# EAGLE design led_analog_watch_face_v1_1 (EAGLE 5.11)
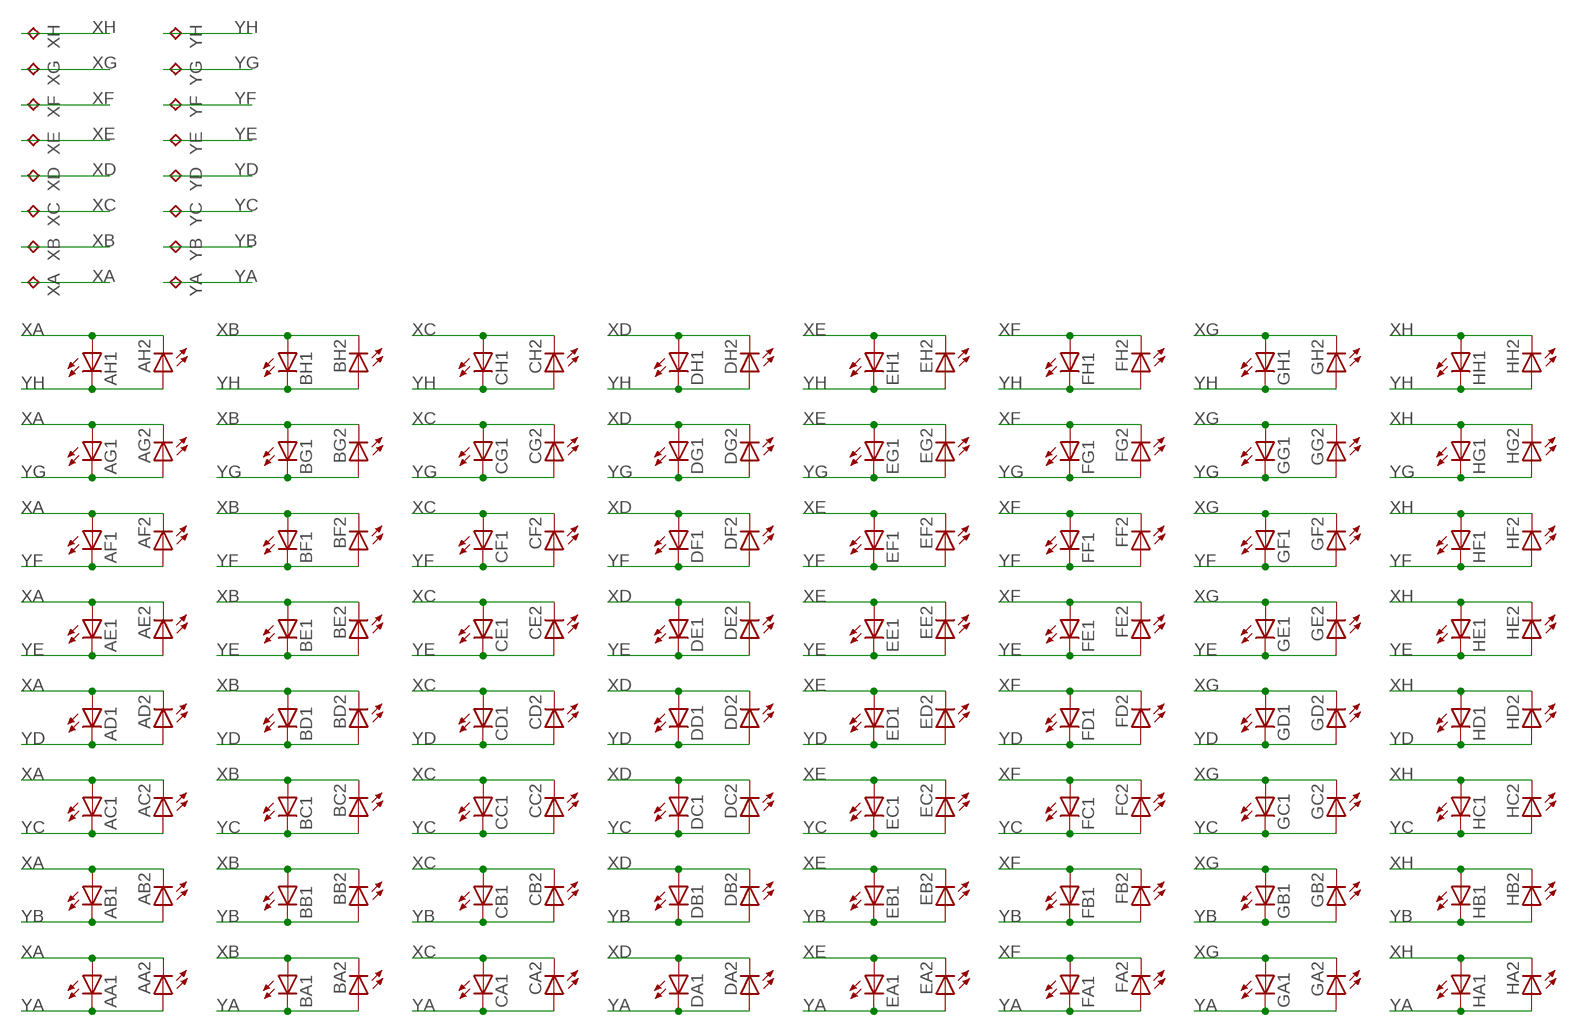
[diagram p0: schematic, sheet 1]

## Parts
AA1  LED-0402  [0402]
AA2  LED-0402  [0402]
AB1  LED-0402  [0402]
AB2  LED-0402  [0402]
AC1  LED-0402  [0402]
AC2  LED-0402  [0402]
AD1  LED-0402  [0402]
AD2  LED-0402  [0402]
AE1  LED-0402  [0402]
AE2  LED-0402  [0402]
AF1  LED-0402  [0402]
AF2  LED-0402  [0402]
AG1  LED-0402  [0402]
AG2  LED-0402  [0402]
AH1  LED-0402  [0402]
AH2  LED-0402  [0402]
BA1  LED-0402  [0402]
BA2  LED-0402  [0402]
BB1  LED-0402  [0402]
BB2  LED-0402  [0402]
BC1  LED-0402  [0402]
BC2  LED-0402  [0402]
BD1  LED-0402  [0402]
BD2  LED-0402  [0402]
BE1  LED-0402  [0402]
BE2  LED-0402  [0402]
BF1  LED-0402  [0402]
BF2  LED-0402  [0402]
BG1  LED-0402  [0402]
BG2  LED-0402  [0402]
BH1  LED-0402  [0402]
BH2  LED-0402  [0402]
CA1  LED-0402  [0402]
CA2  LED-0402  [0402]
CB1  LED-0402  [0402]
CB2  LED-0402  [0402]
CC1  LED-0402  [0402]
CC2  LED-0402  [0402]
CD1  LED-0402  [0402]
CD2  LED-0402  [0402]
CE1  LED-0402  [0402]
CE2  LED-0402  [0402]
CF1  LED-0402  [0402]
CF2  LED-0402  [0402]
CG1  LED-0402  [0402]
CG2  LED-0402  [0402]
CH1  LED-0402  [0402]
CH2  LED-0402  [0402]
DA1  LED-0402  [0402]
DA2  LED-0402  [0402]
DB1  LED-0402  [0402]
DB2  LED-0402  [0402]
DC1  LED-0402  [0402]
DC2  LED-0402  [0402]
DD1  LED-0402  [0402]
DD2  LED-0402  [0402]
DE1  LED-0402  [0402]
DE2  LED-0402  [0402]
DF1  LED-0402  [0402]
DF2  LED-0402  [0402]
DG1  LED-0402  [0402]
DG2  LED-0402  [0402]
DH1  LED-0402  [0402]
DH2  LED-0402  [0402]
EA1  LED-0402  [0402]
EA2  LED-0402  [0402]
EB1  LED-0402  [0402]
EB2  LED-0402  [0402]
EC1  LED-0402  [0402]
EC2  LED-0402  [0402]
ED1  LED-0402  [0402]
ED2  LED-0402  [0402]
EE1  LED-0402  [0402]
EE2  LED-0402  [0402]
EF1  LED-0402  [0402]
EF2  LED-0402  [0402]
EG1  LED-0402  [0402]
EG2  LED-0402  [0402]
EH1  LED-0402  [0402]
EH2  LED-0402  [0402]
FA1  LED-0402  [0402]
FA2  LED-0402  [0402]
FB1  LED-0402  [0402]
FB2  LED-0402  [0402]
FC1  LED-0402  [0402]
FC2  LED-0402  [0402]
FD1  LED-0402  [0402]
FD2  LED-0402  [0402]
FE1  LED-0402  [0402]
FE2  LED-0402  [0402]
FF1  LED-0402  [0402]
FF2  LED-0402  [0402]
FG1  LED-0402  [0402]
FG2  LED-0402  [0402]
FH1  LED-0402  [0402]
FH2  LED-0402  [0402]
GA1  LED-0402  [0402]
GA2  LED-0402  [0402]
GB1  LED-0402  [0402]
GB2  LED-0402  [0402]
GC1  LED-0402  [0402]
GC2  LED-0402  [0402]
GD1  LED-0402  [0402]
GD2  LED-0402  [0402]
GE1  LED-0402  [0402]
GE2  LED-0402  [0402]
GF1  LED-0402  [0402]
GF2  LED-0402  [0402]
GG1  LED-0402  [0402]
GG2  LED-0402  [0402]
GH1  LED-0402  [0402]
GH2  LED-0402  [0402]
HA1  LED-0402  [0402]
HA2  LED-0402  [0402]
HB1  LED-0402  [0402]
HB2  LED-0402  [0402]
HC1  LED-0402  [0402]
HC2  LED-0402  [0402]
HD1  LED-0402  [0402]
HD2  LED-0402  [0402]
HE1  LED-0402  [0402]
HE2  LED-0402  [0402]
HF1  LED-0402  [0402]
HF2  LED-0402  [0402]
HG1  LED-0402  [0402]
HG2  LED-0402  [0402]
HH1  LED-0402  [0402]
HH2  LED-0402  [0402]
XA  TPTP20R  [TP20R]
XB  TPTP20R  [TP20R]
XC  TPTP20R  [TP20R]
XD  TPTP20R  [TP20R]
XE  TPTP20R  [TP20R]
XF  TPTP20R  [TP20R]
XG  TPTP20R  [TP20R]
XH  TPTP20R  [TP20R]
YA  TPTP20R  [TP20R]
YB  TPTP20R  [TP20R]
YC  TPTP20R  [TP20R]
YD  TPTP20R  [TP20R]
YE  TPTP20R  [TP20R]
YF  TPTP20R  [TP20R]
YG  TPTP20R  [TP20R]
YH  TPTP20R  [TP20R]

## Nets
XA: AA1.1(A) AA2.2(C) AB1.1(A) AB2.2(C) AC1.1(A) AC2.2(C) AD1.1(A) AD2.2(C) AE1.1(A) AE2.2(C) AF1.1(A) AF2.2(C) AG1.1(A) AG2.2(C) AH1.1(A) AH2.2(C) XA.TP
XB: BA1.1(A) BA2.2(C) BB1.1(A) BB2.2(C) BC1.1(A) BC2.2(C) BD1.1(A) BD2.2(C) BE1.1(A) BE2.2(C) BF1.1(A) BF2.2(C) BG1.1(A) BG2.2(C) BH1.1(A) BH2.2(C) XB.TP
XC: CA1.1(A) CA2.2(C) CB1.1(A) CB2.2(C) CC1.1(A) CC2.2(C) CD1.1(A) CD2.2(C) CE1.1(A) CE2.2(C) CF1.1(A) CF2.2(C) CG1.1(A) CG2.2(C) CH1.1(A) CH2.2(C) XC.TP
XD: DA1.1(A) DA2.2(C) DB1.1(A) DB2.2(C) DC1.1(A) DC2.2(C) DD1.1(A) DD2.2(C) DE1.1(A) DE2.2(C) DF1.1(A) DF2.2(C) DG1.1(A) DG2.2(C) DH1.1(A) DH2.2(C) XD.TP
XE: EA1.1(A) EA2.2(C) EB1.1(A) EB2.2(C) EC1.1(A) EC2.2(C) ED1.1(A) ED2.2(C) EE1.1(A) EE2.2(C) EF1.1(A) EF2.2(C) EG1.1(A) EG2.2(C) EH1.1(A) EH2.2(C) XE.TP
XF: FA1.1(A) FA2.2(C) FB1.1(A) FB2.2(C) FC1.1(A) FC2.2(C) FD1.1(A) FD2.2(C) FE1.1(A) FE2.2(C) FF1.1(A) FF2.2(C) FG1.1(A) FG2.2(C) FH1.1(A) FH2.2(C) XF.TP
XG: GA1.1(A) GA2.2(C) GB1.1(A) GB2.2(C) GC1.1(A) GC2.2(C) GD1.1(A) GD2.2(C) GE1.1(A) GE2.2(C) GF1.1(A) GF2.2(C) GG1.1(A) GG2.2(C) GH1.1(A) GH2.2(C) XG.TP
XH: HA1.1(A) HA2.2(C) HB1.1(A) HB2.2(C) HC1.1(A) HC2.2(C) HD1.1(A) HD2.2(C) HE1.1(A) HE2.2(C) HF1.1(A) HF2.2(C) HG1.1(A) HG2.2(C) HH1.1(A) HH2.2(C) XH.TP
YA: AA1.2(C) AA2.1(A) BA1.2(C) BA2.1(A) CA1.2(C) CA2.1(A) DA1.2(C) DA2.1(A) EA1.2(C) EA2.1(A) FA1.2(C) FA2.1(A) GA1.2(C) GA2.1(A) HA1.2(C) HA2.1(A) YA.TP
YB: AB1.2(C) AB2.1(A) BB1.2(C) BB2.1(A) CB1.2(C) CB2.1(A) DB1.2(C) DB2.1(A) EB1.2(C) EB2.1(A) FB1.2(C) FB2.1(A) GB1.2(C) GB2.1(A) HB1.2(C) HB2.1(A) YB.TP
YC: AC1.2(C) AC2.1(A) BC1.2(C) BC2.1(A) CC1.2(C) CC2.1(A) DC1.2(C) DC2.1(A) EC1.2(C) EC2.1(A) FC1.2(C) FC2.1(A) GC1.2(C) GC2.1(A) HC1.2(C) HC2.1(A) YC.TP
YD: AD1.2(C) AD2.1(A) BD1.2(C) BD2.1(A) CD1.2(C) CD2.1(A) DD1.2(C) DD2.1(A) ED1.2(C) ED2.1(A) FD1.2(C) FD2.1(A) GD1.2(C) GD2.1(A) HD1.2(C) HD2.1(A) YD.TP
YE: AE1.2(C) AE2.1(A) BE1.2(C) BE2.1(A) CE1.2(C) CE2.1(A) DE1.2(C) DE2.1(A) EE1.2(C) EE2.1(A) FE1.2(C) FE2.1(A) GE1.2(C) GE2.1(A) HE1.2(C) HE2.1(A) YE.TP
YF: AF1.2(C) AF2.1(A) BF1.2(C) BF2.1(A) CF1.2(C) CF2.1(A) DF1.2(C) DF2.1(A) EF1.2(C) EF2.1(A) FF1.2(C) FF2.1(A) GF1.2(C) GF2.1(A) HF1.2(C) HF2.1(A) YF.TP
YG: AG1.2(C) AG2.1(A) BG1.2(C) BG2.1(A) CG1.2(C) CG2.1(A) DG1.2(C) DG2.1(A) EG1.2(C) EG2.1(A) FG1.2(C) FG2.1(A) GG1.2(C) GG2.1(A) HG1.2(C) HG2.1(A) YG.TP
YH: AH1.2(C) AH2.1(A) BH1.2(C) BH2.1(A) CH1.2(C) CH2.1(A) DH1.2(C) DH2.1(A) EH1.2(C) EH2.1(A) FH1.2(C) FH2.1(A) GH1.2(C) GH2.1(A) HH1.2(C) HH2.1(A) YH.TP

## Library data of the parts
AA1 AA2 AB1 AB2 AC1 AC2 AD1 AD2 AE1 AE2 AF1 AF2 AG1 AG2 AH1 AH2 BA1 BA2 BB1 BB2 BC1 BC2 BD1 BD2 BE1 BE2 BF1 BF2 BG1 BG2 BH1 BH2 CA1 CA2 CB1 CB2 CC1 CC2 CD1 CD2 CE1 CE2 CF1 CF2 CG1 CG2 CH1 CH2 DA1 DA2 DB1 DB2 DC1 DC2 DD1 DD2 DE1 DE2 DF1 DF2 DG1 DG2 DH1 DH2 EA1 EA2 EB1 EB2 EC1 EC2 ED1 ED2 EE1 EE2 EF1 EF2 EG1 EG2 EH1 EH2 FA1 FA2 FB1 FB2 FC1 FC2 FD1 FD2 FE1 FE2 FF1 FF2 FG1 FG2 FH1 FH2 GA1 GA2 GB1 GB2 GC1 GC2 GD1 GD2 GE1 GE2 GF1 GF2 GG1 GG2 GH1 GH2 HA1 HA2 HB1 HB2 HC1 HC2 HD1 HD2 HE1 HE2 HF1 HF2 HG1 HG2 HH1 HH2 = jcole:LED: LEDs Standard schematic elements and footprints for 5mm, 3mm, 1206, and 0603 sized LEDs. 5mm - Spark Fun Electronics SKU : COM-00529 (and others)
XA XB XC XD XE XF XG XH YA YB YC YD YE YF YG YH = testpad:TP: Test pad

## Net classes
0 signal: width 0.203 mm
1 supply: width 0.305 mm

## Board
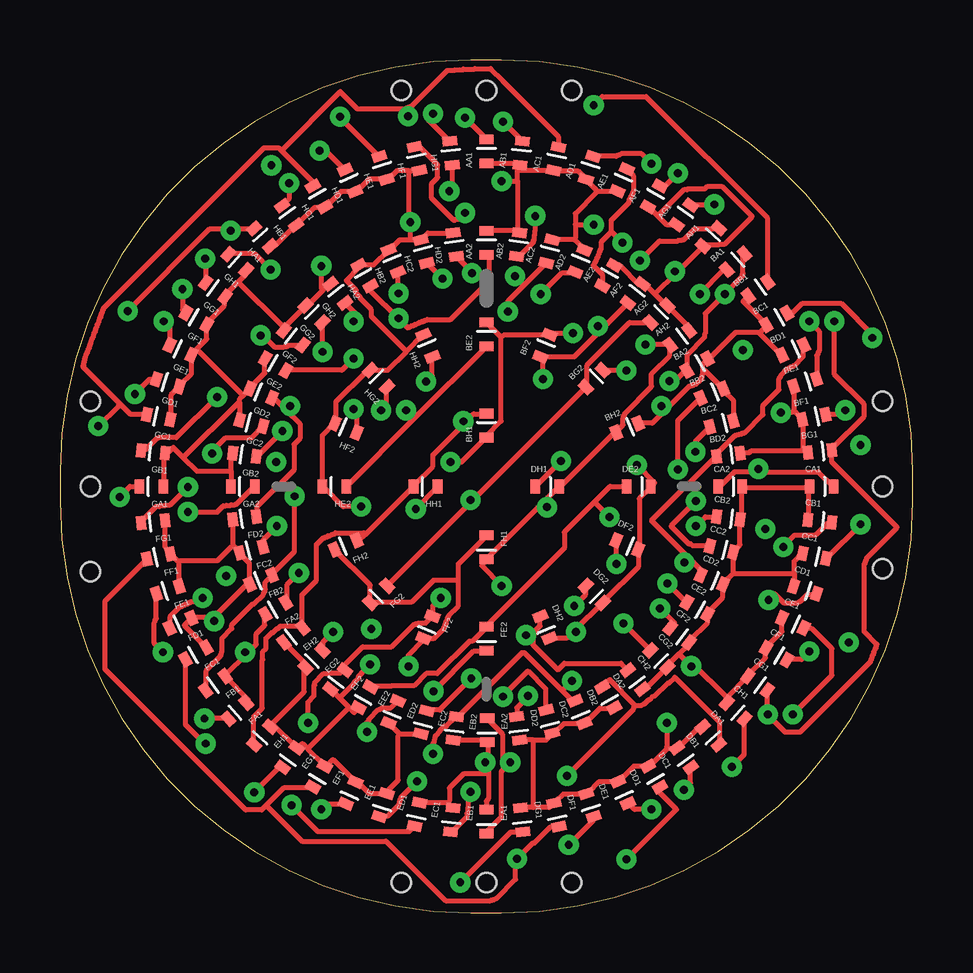
[diagram p1: board, top side]
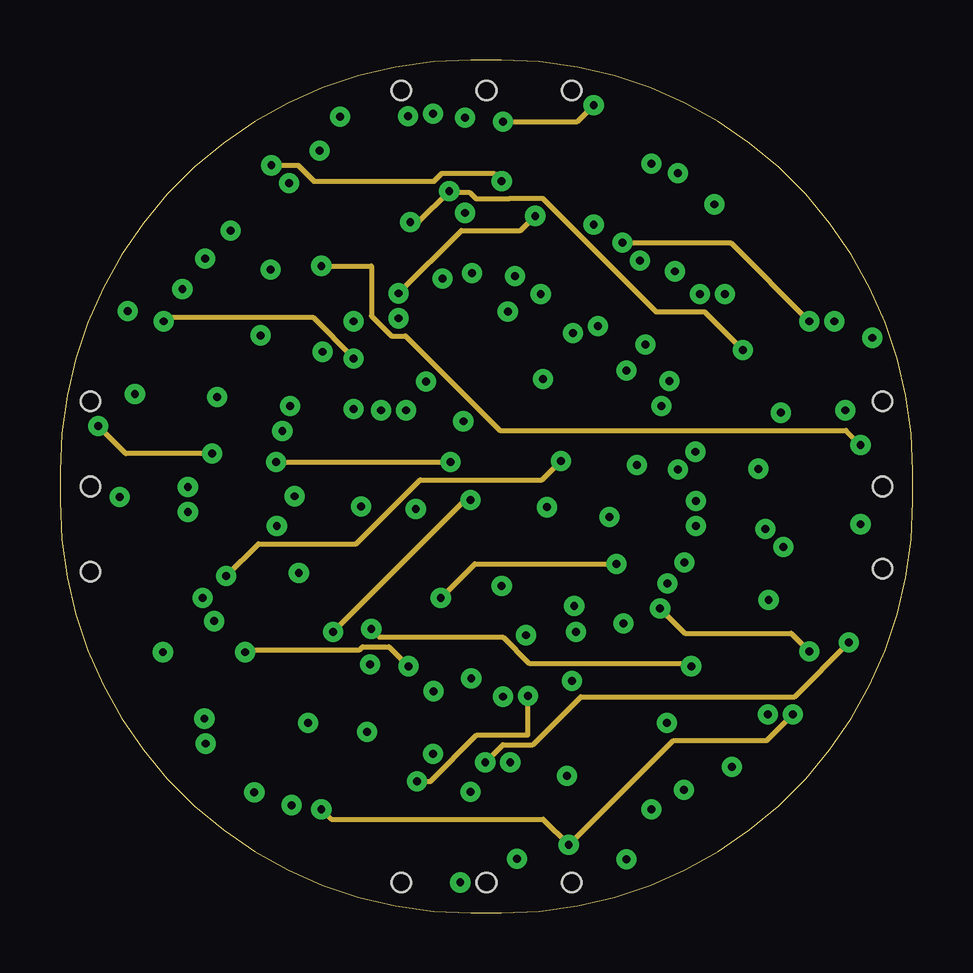
[diagram p2: board, inner layer Route2]
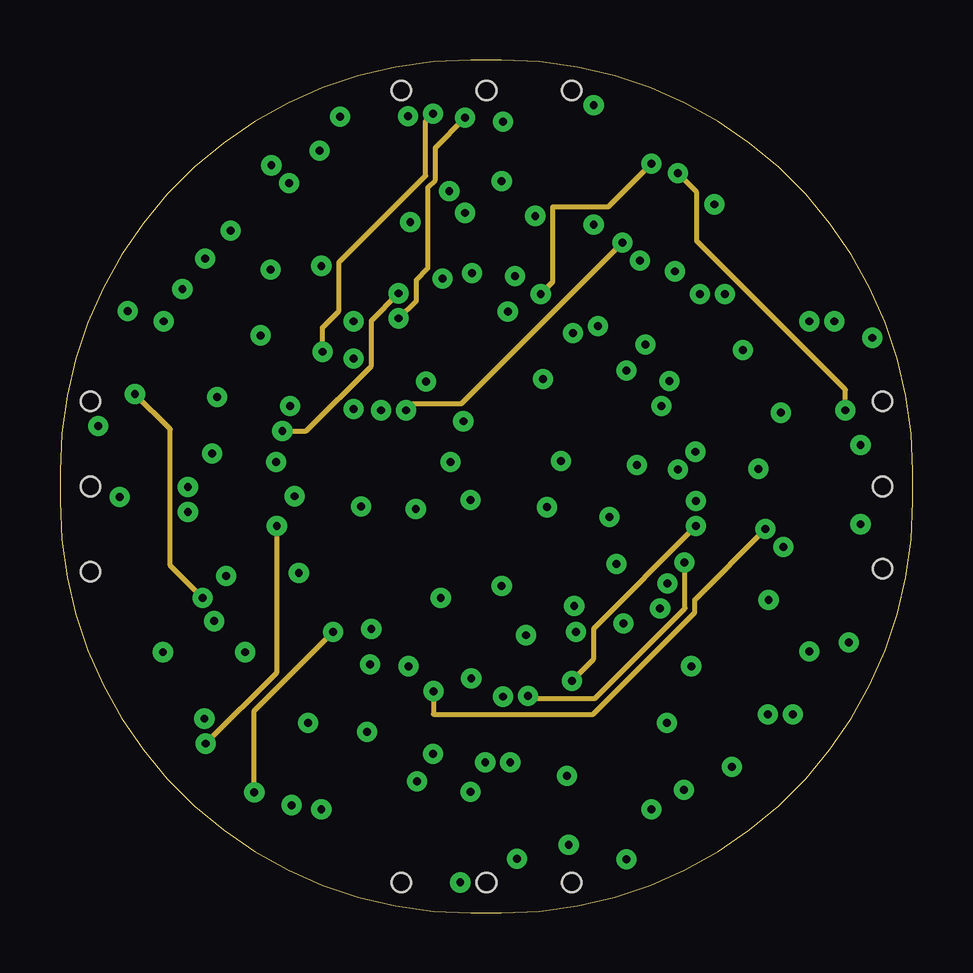
[diagram p3: board, inner layer Route15]
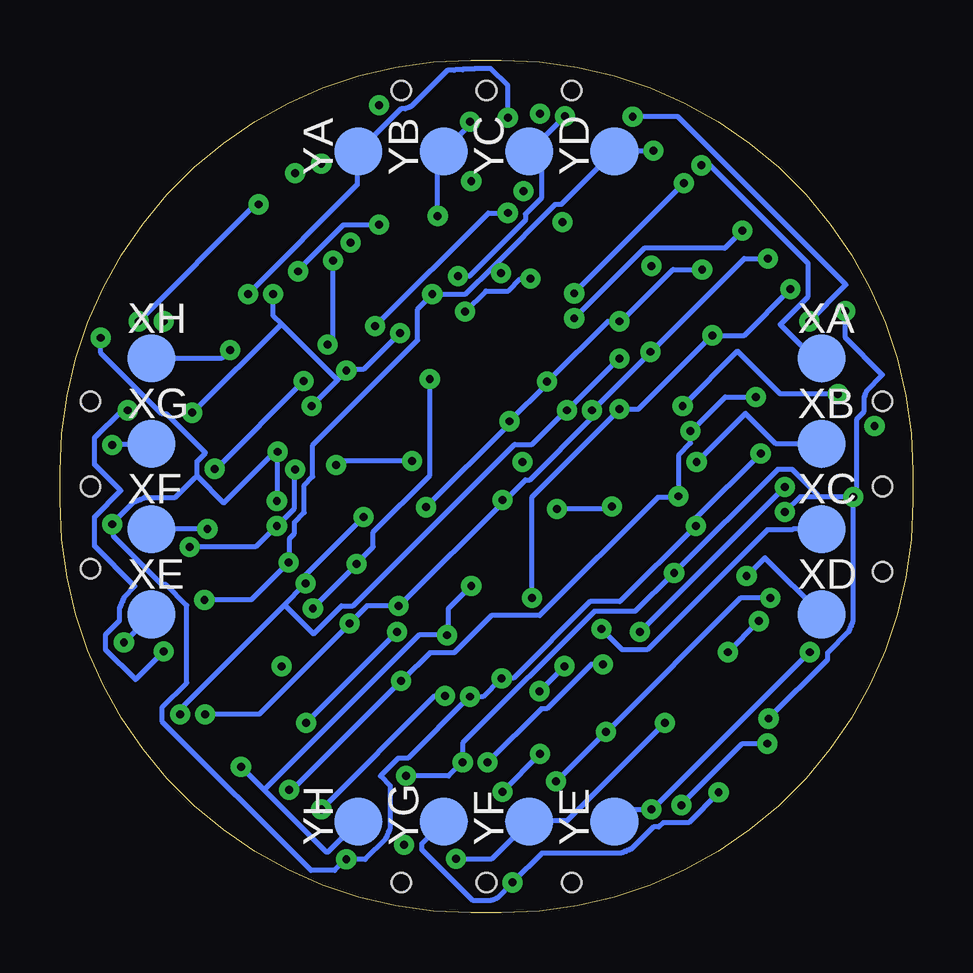
[diagram p4: board, bottom side, seen from below]

Size 35.56 x 35.56 mm. Coordinates in mm from the lower left corner, seen from the top.
Outline: 18.42,0 arc90 35.56,17.14 35.56,18.41 arc90 18.42,35.56 17.14,35.56 arc90 0,18.41 0,17.14 arc90 17.14,0 18.42,0
Copper layers (1*2*15*16): Top 0.035mm / dielectric 0.6mm / Route2 0.035mm / dielectric 0.15mm / Route15 0.035mm / dielectric 0.6mm / Bottom 0.035mm
Design rules "SparkFun *": minimum track width 8mil, minimum drill 13mil, track to track 8mil, track to pad 8mil, pad to pad 8mil, via to via 8mil, smd to smd 8mil, copper to edge 10mil, drill to drill 8mil, minimum pad ring 12mil, minimum via ring 10mil, stop-mask expansion 4mil, vias tented up to drill 25mil, thermal gap 10mil
Holes 0.8 mm at 17.78,1.27 34.29,17.78 1.27,17.78 17.78,34.29 1.27,21.34 1.27,14.22 14.22,1.27 21.34,1.27 34.29,21.34 34.29,14.35 14.22,34.29 21.34,34.29

### Footprints (pad centres in the part's own frame; a part is rotated, then mirrored left to right if it is on the bottom)
0402 = smd 0.6 x 0.4: 1 0,-0.5; 2 0,0.5
TP20R = smd 2 x 2: TP 0,0

### Placement (x,y rotation side)
AA1  17.78,31.75 0 top
AA2  17.78,27.94 0 top
AB1  19.23,31.67 354 top
AB2  19.1,27.86 352.5 top
AC1  20.68,31.44 348 top
AC2  20.4,27.58 345 top
AD1  22.08,31.06 342 top
AD2  21.67,27.18 337.5 top
AE1  23.43,30.55 336 top
AE2  22.86,26.57 330 top
AF1  24.77,29.88 330 top
AF2  23.98,25.83 322.5 top
AG1  26,29.1 324 top
AG2  24.97,24.97 315 top
AH1  27.14,28.18 318 top
AH2  25.83,23.98 307.5 top
BA1  28.17,27.15 312 top
BA2  26.57,22.86 300 top
BB1  29.1,26.02 306 top
BB2  27.18,21.67 292.5 top
BC1  29.87,24.76 300 top
BC2  27.58,20.4 285 top
BD1  30.55,23.47 294 top
BD2  27.86,19.1 277.5 top
BE1  31.06,22.11 288 top
BE2  17.78,24.13 0 top
BF1  31.43,20.67 282 top
BF2  20.22,23.65 337.5 top
BG1  31.67,19.25 276 top
BG2  22.28,22.28 315 top
BH1  17.78,20.32 0 top
BH2  23.65,20.22 292.5 top
CA1  31.75,17.78 270 top
CA2  27.94,17.78 270 top
CB1  31.67,16.33 264 top
CB2  27.86,16.46 262.5 top
CC1  31.45,14.88 258 top
CC2  27.58,15.16 255 top
CD1  31.06,13.46 252 top
CD2  27.18,13.89 247.5 top
CE1  30.56,12.09 246 top
CE2  26.57,12.7 240 top
CF1  29.87,10.79 240 top
CF2  25.83,11.58 232.5 top
CG1  29.08,9.58 234 top
CG2  24.97,10.59 225 top
CH1  28.17,8.43 228 top
CH2  23.98,9.73 217.5 top
DA1  27.13,7.39 222 top
DA2  22.86,8.99 210 top
DB1  26.01,6.48 216 top
DB2  21.67,8.38 202.5 top
DC1  24.77,5.69 210 top
DC2  20.4,7.98 195 top
DD1  23.47,5.03 204 top
DD2  19.1,7.7 187.5 top
DE1  22.1,4.5 198 top
DE2  24.13,17.78 270 top
DF1  20.7,4.09 192 top
DF2  23.65,15.34 247.5 top
DG1  19.25,3.89 186 top
DG2  22.28,13.28 225 top
DH1  20.32,17.78 270 top
DH2  20.22,11.91 202.5 top
EA1  17.78,3.81 180 top
EA2  17.81,7.62 180 top
EB1  16.33,3.89 174 top
EB2  16.46,7.7 172.5 top
EC1  14.88,4.11 168 top
EC2  15.16,7.95 165 top
ED1  13.46,4.5 162 top
ED2  13.89,8.38 157.5 top
EE1  12.12,5 156 top
EE2  12.7,8.99 150 top
EF1  10.79,5.69 150 top
EF2  11.58,9.73 142.5 top
EG1  9.58,6.48 144 top
EG2  10.59,10.59 135 top
EH1  8.43,7.39 138 top
EH2  9.73,11.58 127.5 top
FA1  7.39,8.43 132 top
FA2  8.99,12.7 120 top
FB1  6.48,9.58 126 top
FB2  8.38,13.89 112.5 top
FC1  5.66,10.82 120 top
FC2  7.98,15.14 105 top
FD1  5.03,12.09 114 top
FD2  7.7,16.46 97.5 top
FE1  4.5,13.46 108 top
FE2  17.78,11.43 180 top
FF1  4.11,14.86 102 top
FF2  15.34,11.91 157.5 top
FG1  3.89,16.31 96 top
FG2  13.28,13.28 135 top
FH1  17.78,15.24 180 top
FH2  11.91,15.34 112.5 top
GA1  3.81,17.78 90 top
GA2  7.62,17.78 90 top
GB1  3.89,19.23 84 top
GB2  7.7,19.1 82.5 top
GC1  4.11,20.68 78 top
GC2  7.98,20.42 75 top
GD1  4.5,22.1 72 top
GD2  8.38,21.67 67.5 top
GE1  5.03,23.47 66 top
GE2  8.99,22.86 60 top
GF1  5.69,24.77 60 top
GF2  9.73,23.98 52.5 top
GG1  6.48,25.98 54 top
GG2  10.59,24.97 45 top
GH1  7.39,27.13 48 top
GH2  11.58,25.83 37.5 top
HA1  8.43,28.17 42 top
HA2  12.7,26.57 30 top
HB1  9.55,29.08 36 top
HB2  13.89,27.18 22.5 top
HC1  10.79,29.87 30 top
HC2  15.16,27.58 15 top
HD1  12.09,30.53 24 top
HD2  16.46,27.86 7.5 top
HE1  13.46,31.06 18 top
HE2  11.43,17.78 90 top
HF1  14.88,31.45 12 top
HF2  11.91,20.22 67.5 top
HG1  16.31,31.67 6 top
HG2  13.28,22.28 45 top
HH1  15.24,17.78 90 top
HH2  15.34,23.65 22.5 top
XA  3.81,23.11 0 bottom
XB  3.81,19.56 0 bottom
XC  3.81,16 0 bottom
XD  3.81,12.45 0 bottom
XE  31.75,12.45 0 bottom
XF  31.75,16 0 bottom
XG  31.75,19.56 0 bottom
XH  31.75,23.11 0 bottom
YA  23.11,31.75 90 bottom
YB  19.56,31.75 90 bottom
YC  16,31.75 90 bottom
YD  12.45,31.75 90 bottom
YE  12.45,3.81 90 bottom
YF  16,3.81 90 bottom
YG  19.56,3.81 90 bottom
YH  23.11,3.81 90 bottom

### Tracks (layer width: path | path; a pad name or v marks a point on that pad's centre or on a via)
XA  (via drill 0.33)
  Top 0.203: 24.93,29.05 24.54,29.44 AF1.1 | 24.93,29.05 25.27,28.7 AG1.1 | AE2.2 23.34,27 24.18,26.16 24.26,26.24 AF2.2 24.38,26.21 24.8,25.79 | 24.8,25.79 25.27,25.32 25.3,25.32 AG2.2 25.38,25.27 26.21,24.43 26.21,24.28 AH2.2 | 25.69,26.68 26.8,27.79 AH1.1 26.9,27.84 26.92,27.86 27.48,27.86 27.51,27.89 27.71,27.89 28.85,29.03 27.61,30.28 26.98,30.28 26.87,30.18 26.16,30.18 26.14,30.15 26.01,30.15 24.99,29.13 24.99,29.11 24.93,29.05 | 25.69,26.68 24.8,25.79 | 21.44,28.07 20.55,28.07 AC2.2 | 21.44,28.07 21.84,27.66 AD2.2 | 22.4,30.1 23.22,30.1 AE1.1 | 22.4,30.1 22,30.5 AD1.1 21.92,30.61 21.59,30.94 20.6,30.94 AC1.1 20.47,30.96 19.08,30.96 | 21.49,28.7 21.49,29.16 22.35,30.02 22.4,30.1 | 21.49,28.7 21.49,28.14 21.44,28.07 | AA2.2 19.08,28.45 19.15,28.37 AB2.2 19.08,28.52 19.08,30.5 | AA1.1 19.1,31.24 19.15,31.19 AB1.1 19.13,31.09 19.08,31.04 19.08,30.96 | 19.08,30.5 19.08,30.96 | v18.42,30.5 19.08,30.5 | v25.63,26.75 25.69,26.68 | 21.49,28.7 v22.25,28.7
  Route2 0.203: v8.81,31.17 9.93,31.17 10.59,30.5 15.6,30.5 15.93,30.84 18.09,30.84 v18.42,30.5
  Bottom 0.203: XA.TP 4.12,23.11 5.54,24.54 4.37,25.7 4.37,27.08 8.64,31.34 v8.81,31.17 | v25.63,26.75 25.63,26.8 23.75,28.68 22.28,28.68 v22.25,28.7
XB  (via drill 0.33)
  Top 0.203: BD2.2 28.73,19.18 28.8,19.25 31.12,19.25 31.17,19.2 BG1.1 30.96,19.33 30.96,20.55 BF1.1 30.89,20.65 30.61,20.93 | 30.61,20.93 30.61,21.95 BE1.1 | BB1.1 28.68,25.7 28.47,25.5 29.44,24.54 BC1.1 29.41,24.43 29.16,24.18 | 29.16,24.18 30.07,23.27 BD1.1 | 25.23,20.97 26.21,21.95 26.26,21.95 26.31,22 26.39,22 26.44,22.05 26.52,22.05 26.7,22.23 26.72,22.23 26.75,22.25 26.75,22.33 26.77,22.35 26.77,22.43 26.8,22.45 26.8,22.63 | 25.23,20.97 24.69,20.42 24.13,20.42 BH2.2 | 26.8,22.63 26.8,22.89 27,23.09 BA2.2 27.1,23.14 28.17,24.21 29.08,24.21 29.16,24.18 | v23.62,22.61 22.63,22.61 BG2.2 | v25.07,21.13 25.23,20.97 | 26.8,22.63 26.87,22.63 BB2.2 27.69,21.77 28.07,21.39 28.07,20.55 BC2.2 | v26.67,25.81 27.66,26.8 27.79,26.8 BA1.1 | v30.05,20.85 30.07,20.88 30.53,20.88 30.61,20.93 | 18.39,24 18.39,20.5 17.78,19.89 BH1.1 17.7,19.76 16.74,18.8 v16.28,18.8 | 18.39,24 17.78,24.61 BE2.2 | 18.39,24 18.47,24.05 18.52,24.11 20.4,24.11 BF2.2 20.5,24.16 20.52,24.18 v21.39,24.18
  Route2 0.203: v9.02,18.8 v16.28,18.8
  Bottom 0.203: 23.99,22.21 v25.07,21.13 | 23.99,22.21 23.62,22.58 v23.62,22.61 23.55,22.66 22.91,22.66 v21.39,24.18 | v26.67,25.81 26.67,24.89 26.33,24.55 | 23.99,22.21 26.33,24.55 | v30.05,20.85 30.02,20.85 26.33,24.55 | XB.TP 5.71,19.56 6.99,20.83 v9.02,18.8
XC  (via drill 0.33)
  Top 0.203: 27.81,8.99 27.81,8.79 CH1.1 | 27.81,8.99 28.68,9.86 CG1.1 28.73,9.96 29.41,10.64 29.41,11.02 CF1.1 29.49,11.12 30.1,11.73 CE1.1 | CE1.1 | 30.61,14.15 30.61,14.66 30.94,14.99 CC1.1 | 30.61,14.15 30.61,13.64 CD1.1 | CB1.1 31.19,16.41 31.19,17.73 CA1.1 31.12,17.73 28.52,17.73 CA2.2 28.42,17.78 28.42,16.51 28.4,16.48 CB2.2 28.35,16.38 28.35,15.34 28.12,15.11 CC2.2 28.07,15.01 28.07,14.17 | CH2.2 24.28,9.35 24.41,9.35 25.3,10.24 CG2.2 25.35,10.34 25.81,10.79 | 25.81,10.79 26.21,11.2 26.21,11.28 CF2.2 26.26,11.38 27,12.12 CE2.2 27.03,12.55 27.64,13.16 CD2.2 27.69,13.79 28.07,14.17 | 30.61,14.15 28.14,14.15 28.07,14.17 | 25.81,10.79 v26.31,10.29 26.39,10.34 26.42,10.36 27.74,9.04 27.81,8.99
  Route2 0.203: v12.98,11.84 13.31,11.51 18.47,11.51 19.56,10.41 26.19,10.41 v26.31,10.29
  Bottom 0.203: XC.TP 5,16 5.03,15.98 6.07,15.98 11.07,10.97 12.12,10.97 v12.98,11.84
XD  (via drill 0.33)
  Top 0.203: 19.74,7.21 20.27,7.21 20.52,7.47 DC2.2 20.62,7.52 21.01,7.9 21.84,7.9 DB2.2 21.95,7.98 22.5,8.53 23.09,8.53 DA2.2 | 19.74,7.21 19.18,7.21 DD2.2 | 19.74,4.39 20.4,4.39 20.57,4.57 DF1.1 20.68,4.65 20.98,4.95 21.92,4.95 DE1.1 22.02,5.03 22.45,5.46 23.24,5.46 DD1.1 23.34,5.54 23.93,6.12 DC1.1 24.61,6.15 25.32,6.86 | 19.74,4.39 19.2,4.39 DG1.1 | 25.32,6.86 25.71,6.86 DB1.1 25.81,6.91 26.64,7.75 26.77,7.75 DA1.1 | 19.74,4.39 19.74,7.21 | 21.45,11.77 22.61,12.93 DG2.2 22.68,13.01 24.11,14.43 24.11,15.14 DF2.2 24.16,15.24 24.16,17.27 24.59,17.7 DE2.2 24.79,17.93 v24.05,18.67 | 21.45,11.77 21.13,11.46 DH2.2 | v20.88,18.85 19.84,17.8 19.84,17.78 DH1.1 | v25.3,7.92 25.3,6.93 25.32,6.86 | 21.45,11.77 v21.51,11.71
  Route2 0.203: v6.93,14.05 8.28,15.39 12.34,15.39 15.01,18.06 20.09,18.06 v20.88,18.85
  Bottom 0.203: v20.88,18.85 23.88,18.85 v24.05,18.67 | XD.TP 6.17,14.81 v6.93,14.05 | v21.51,11.71 v25.3,7.92
XE  (via drill 0.33)
  Top 0.203: EH2.2 9.35,11.28 10.31,10.31 EG2.2 10.18,10.16 10.18,9.22 8.89,7.92 8.89,7.85 | 12.05,8.57 12.27,8.36 12.45,8.53 EE2.2 | 12.05,8.57 11.67,8.95 | 11.67,8.95 11.3,9.32 EF2.2 | 14.15,7.47 15.01,7.47 EC2.2 | 14.15,7.47 13.72,7.9 ED2.2 | 8.89,7.85 9.85,6.88 EG1.1 9.96,6.91 10.11,7.06 10.32,6.84 | 8.89,7.85 8.79,7.75 EH1.1 | 10.32,6.84 11.02,6.15 EF1.1 11.12,6.15 11.38,6.4 EE1.1 12.42,5.44 12.88,4.98 ED1.1 13.64,5.08 14.1,5.54 14.1,7.39 14.15,7.47 | 10.32,6.84 12.05,8.57 | 16.18,4.6 15.01,4.6 EC1.1 | 16.18,4.6 16.38,4.39 EB1.1 | 17.86,6.27 17.86,7.06 EA2.2 17.76,7.19 16.41,7.19 EB2.2 | 17.86,6.27 17.86,5.79 | 17.86,5.79 17.86,4.75 17.78,4.67 EA1.1 | 16.18,4.6 16.23,4.67 16.23,5.21 16.82,5.79 17.86,5.79 | v17.73,6.27 17.86,6.27 | v12.93,10.36 12.57,10.01 12.57,9.98 12.45,9.86 12.45,9.8 12.27,9.63 12.27,9.58 11.73,9.04 11.73,9.02 11.67,8.95
  Route2 0.203: v32.89,11.28 30.63,9.02 21.72,9.02 19.71,7.01 18.47,7.01 v17.73,6.27
  Bottom 0.203: XE.TP 31.75,12.42 v32.89,11.28 | v12.93,10.36 13.41,10.36 15.26,8.51 15.49,8.51 v17.73,6.27
XF  (via drill 0.33)
  Top 0.203: FA1.1 7.75,8.79 7.85,8.89 6.88,9.86 FB1.1 6.93,9.96 7.79,10.81 | 7.79,10.81 8.18,11.2 8.18,11.63 8.53,11.99 8.53,12.45 FA2.2 | 4.95,14.63 4.95,13.64 FE1.1 | 4.95,14.63 4.62,14.96 FF1.1 4.57,15.06 4.39,15.24 FG1.1 | FD1.1 5.18,11.99 FC1.1 | FD1.1 | 7.21,15.32 FD2.2 | 7.21,15.32 7.44,15.09 FC2.2 7.49,14.99 7.9,14.58 7.9,13.72 FB2.2 7.8,13.72 6.4,12.32 | 6.4,12.32 5.59,12.32 FD1.1 | 4.95,14.63 5.03,14.68 6.55,14.68 7.14,15.27 7.21,15.32 | v6.43,12.17 6.43,12.24 6.4,12.32 | 7.79,10.81 v7.72,10.87 | FH2.2 11.46,15.14 12.93,13.66 12.93,12.95 FG2.2 13.03,12.95 14.66,12.95 15.57,13.87 16.61,13.87 | 16.61,13.87 16.61,14.55 17.78,15.72 FH1.1 | 16.61,13.87 16.61,12.8 16.21,12.39 16.21,12.34 16.15,12.29 16.15,12.22 16.1,12.17 16.1,12.09 16.05,12.04 16.05,11.96 16,11.91 16,11.86 15.6,11.46 15.16,11.46 FF2.2 15.14,11.35 14.53,10.74 v14.53,10.29 | v15.57,9.25 17.25,10.92 FE2.2
  Route2 0.203: v7.72,10.87 7.82,10.97 12.5,10.97 12.62,11.1 13.72,11.1 v14.53,10.29
  Route15 0.203: v29.41,16 26.47,13.06 26.47,12.52 22.23,8.28 15.57,8.28 v15.57,9.25
  Bottom 0.203: v7.72,10.87 v6.43,12.17 | v14.53,10.29 v15.57,9.25 | v29.41,16 XF.TP
XG  (via drill 0.33)
  Top 0.203: 7.14,18.41 7.14,19.1 7.19,19.15 GB2.2 | 7.14,18.41 7.14,17.78 GA2.2 | GA1.1 4.32,19.1 4.37,19.15 GB1.1 4.47,19.15 4.72,19.41 5.14,18.99 | 5.14,18.99 5.71,18.41 7.14,18.41 | 10.96,25.97 10.34,25.35 GG2.2 10.24,25.3 9.35,24.41 9.35,24.28 GF2.2 9.27,24.46 7.43,26.3 | 10.96,25.97 11.2,26.21 11.28,26.21 GH2.2 | 7.49,21.26 7.49,21.44 7.63,21.58 | 7.49,21.26 7.49,20.57 GC2.2 | 7.63,21.58 7.9,21.84 GD2.2 7.98,21.95 8.53,22.5 8.53,23.09 GE2.2 | GC1.1 4.62,20.57 4.62,21.59 4.95,21.92 GD1.1 5.03,22.02 5.46,22.45 5.46,23.24 GE1.1 | GE1.1 5.54,23.34 6.12,23.93 GF1.1 6.15,24.61 6.86,25.32 6.86,25.68 GG1.1 6.91,25.78 7.43,26.3 | 7.43,26.3 7.75,26.62 7.75,26.77 GH1.1 | 7.63,21.58 5.77,23.44 GE1.1 | v10.9,26.98 10.9,26.04 10.96,25.97 | 5.14,18.99 7.42,21.26 7.49,21.26
  Route2 0.203: v33.38,19.51 32.77,20.12 18.34,20.12 14.4,24.05 13.82,24.05 12.98,24.89 12.98,26.98 v10.9,26.98
  Bottom 0.203: XG.TP 33.32,19.56 v33.38,19.51
XH  (via drill 0.33)
  Top 0.203: 14.44,23.41 15.14,24.11 HH2.2 | 14.44,23.41 13.66,22.63 12.95,22.63 HG2.2 12.85,22.58 12.78,22.58 11.51,21.31 11.51,20.5 HF2.2 11.43,20.4 10.95,19.91 10.95,17.78 HE2.2 11.02,17.73 11.81,16.94 v12.55,16.94 | v14.83,16.84 15.72,17.73 15.72,17.78 HH1.1 | HA1.1 8.79,27.81 8.97,27.81 9.83,28.68 HB1.1 9.93,28.73 10.62,29.41 11.02,29.41 HC1.1 11.12,29.49 11.71,30.07 HD1.1 | HD1.1 | HD1.1 12.39,30.1 12.88,30.58 HE1.1 13.72,30.61 14.05,30.94 14.55,30.94 | 14.55,30.94 14.99,30.94 HF1.1 | 14.6,28.07 14.17,28.07 13.79,27.69 HB2.2 13.69,27.64 13.08,27.03 12.47,27.03 HA2.2 12.5,26.92 11.94,26.36 12.34,25.96 12.34,25.83 12.52,25.65 12.52,25.6 12.98,25.15 12.98,24.87 14.44,23.41 | 14.6,28.07 15.01,28.07 HC2.2 15.11,28.12 15.34,28.35 16.38,28.35 HD2.2 | v16.23,30.1 16.36,30.23 16.36,31.17 HG1.1 | 14.6,28.07 v14.6,28.8 14.55,28.88 14.55,30.94
  Route2 0.203: v14.6,28.8 14.93,28.8 v16.23,30.1 16.31,30.05 17.07,30.05 17.35,29.77 18.72,29.77 18.75,29.79 20.12,29.79 24.84,25.07 26.87,25.07 v28.47,23.47
  Bottom 0.203: v14.83,16.84 12.65,16.84 v12.55,16.94 | XH.TP 28.83,23.11 v28.47,23.47
YA  (via drill 0.33)
  Top 0.203: v16.89,33.15 AA1.2 | 29.11,18.39 31.62,18.39 32.23,17.78 CA1.2 | 29.11,18.39 28.12,18.39 27.51,17.78 CA2.1 | BA1.2 28.52,27.46 28.47,27.41 28.47,26.67 28.45,26.64 28.45,26.54 v27.71,25.81 26.9,24.99 26.9,24.16 26.87,24.13 26.87,24 26.14,23.27 26.14,22.63 BA2.1 26.04,22.58 25.63,22.17 v25.4,22.17 | v29.11,18.52 29.11,18.39 | 14.11,24.78 14.5,24.38 14.55,24.43 14.6,24.43 14.66,24.49 14.73,24.49 14.78,24.54 14.86,24.54 14.91,24.59 14.96,24.59 14.99,24.61 15.04,24.61 15.09,24.66 15.16,24.66 15.21,24.71 15.29,24.71 15.32,24.74 16.28,24.74 17.91,26.36 17.91,27.3 AA2.1 | 14.11,24.78 12.95,25.93 12.95,26.11 HA2.1 | 23.98,8.66 24.26,8.66 24.31,8.71 24.36,8.71 24.54,8.89 24.59,8.89 24.74,9.04 24.79,9.04 25.32,9.58 25.38,9.58 25.63,9.83 27.48,7.98 27.48,7.04 DA1.2 | 23.98,8.66 22.91,9.73 22.63,9.45 DA2.1 | 18.47,6.27 18.47,7.44 17.8,8.1 EA2.1 | 18.47,6.27 18.47,5.97 18.39,5.89 18.39,3.99 17.78,3.38 EA1.2 | v2.49,17.35 2.92,17.78 GA1.2 | v5.33,16.71 6.55,16.71 6.81,16.97 6.91,16.97 6.93,16.99 7.11,16.99 7.14,17.02 7.29,17.02 7.32,17.04 7.37,17.04 8.1,17.78 GA2.1 | v6.02,8.1 7.01,8.1 FA1.2 | v9.96,14.17 9.45,13.66 9.45,12.95 FA2.1 | 7.11,28.52 6.25,28.52 v2.82,25.09 | 7.11,28.52 8.08,28.52 HA1.2 | v18.77,6.27 18.47,6.27 | v21.13,5.71 23.93,8.51 23.93,8.59 23.98,8.66 | v14.12,24.79 14.11,24.78 | 7.11,28.52 v7.11,28.45
  Route15 0.203: v16.89,33.15 15.65,31.9 15.65,30.56 15.34,30.25 15.34,26.87 14.86,26.39 14.86,25.53 v14.12,24.79
  Bottom 0.203: v16.89,33.15 16.89,34.49 17.6,35.2 18.26,35.2 18.29,35.18 18.75,35.18 18.77,35.15 19.1,35.15 19.13,35.13 19.41,35.13 20.9,33.63 20.96,33.63 21.01,33.58 21.06,33.58 21.08,33.55 21.13,33.55 21.16,33.53 21.34,33.53 YA.TP 23.17,31.67 23.17,30.35 v27.71,25.81 | v29.11,18.52 29.06,18.52 v25.4,22.17 | 3.96,17.35 4.7,17.35 v5.33,16.71 | v2.49,17.35 3.96,17.35 | v6.02,8.1 3.56,10.57 3.56,10.85 2.67,11.73 2.67,11.79 2.62,11.84 2.62,11.91 2.57,11.96 2.57,12.04 2.51,12.09 2.51,12.14 2.49,12.17 v2.49,17.35 | 3.96,17.35 3.96,17.42 5.03,18.49 5.64,18.49 v9.96,14.17 10.03,14.12 11.58,12.57 13.28,12.57 18.77,7.09 v18.77,6.27 18.85,6.22 19.36,5.71 v21.13,5.71 | v2.82,25.09 2.82,23.98 1.27,22.43 1.93,21.77 1.93,21.72 1.98,21.67 1.98,21.61 2.01,21.59 2.01,21.54 2.03,21.51 2.03,20.9 2.34,20.6 2.34,17.53 2.44,17.42 v2.49,17.35 | v14.12,24.79 11.2,27.71 7.85,27.71 v7.11,28.45
YB  (via drill 0.33)
  Top 0.203: v14.12,25.83 14.1,25.86 14.1,26.7 HB2.1 | v9.55,30.43 9.55,29.77 9.27,29.49 HB1.2 | v19.81,29.06 19.81,28.45 19.79,28.42 19.79,28.27 19.76,28.25 19.76,28.07 19.74,28.04 19.74,27.96 19.15,27.38 19.05,27.38 AB2.1 | v18.47,32.99 19.28,32.18 AB1.2 | v22.25,33.68 22.61,34.04 24.44,34.04 29.49,28.98 29.49,26.31 BB1.2 | FB1.2 6.1,9.3 6.1,10.11 6.71,10.72 6.71,10.79 6.73,10.82 6.73,10.87 6.76,10.9 6.76,11.46 7.16,11.86 7.16,12.01 8.03,12.88 8.08,12.88 8.48,13.28 8.48,13.34 8.53,13.39 8.53,13.46 8.56,13.49 8.56,13.79 8.84,14.07 FB2.1 8.89,14.17 9.78,15.06 v9.78,17.37 | v9.27,20.09 8.23,19.05 GB2.1 | v6.55,21.51 4.85,19.81 4.12,19.81 4.09,19.79 4.04,19.79 3.56,19.3 3.4,19.3 GB1.2 | v26.52,16.13 26.9,16.51 27.36,16.51 CB2.1 | v25.76,18.49 25.76,20.52 26.7,21.46 BB2.1 | v30.15,15.27 30.63,15.75 31.45,15.75 31.47,15.77 31.52,15.77 32,16.26 32.16,16.26 CB1.2 | v17.12,5.05 17.04,4.98 17.04,4.65 17.02,4.62 17.02,4.39 16.99,4.37 16.99,4.17 16.97,4.14 16.97,4.01 16.36,3.4 16.28,3.4 EB1.2 | v15.54,6.63 15.54,7.04 15.57,7.06 15.57,7.11 15.6,7.14 15.6,7.21 15.62,7.24 15.62,7.32 15.65,7.34 15.65,7.39 15.82,7.57 15.82,7.59 16,7.77 16.1,7.77 16.51,8.18 EB2.1 16.61,8.2 19.25,10.85 19.36,10.85 20.92,9.28 | 20.92,9.28 21.34,8.87 21.46,8.87 DB2.1 | v26.01,5.13 26.29,5.41 26.29,6.07 DB1.2 | v21.34,9.68 21.31,9.68 20.92,9.28
  Route2 0.203: v22.25,33.68 21.57,32.99 v18.47,32.99 | v14.12,25.83 16.74,28.45 19.2,28.45 v19.81,29.06
  Route15 0.203: v26.52,16.13 22.25,11.86 22.25,10.59 v21.34,9.68 | v14.12,25.83 12.98,24.69 12.98,22.81 10.26,20.09 v9.27,20.09
  Bottom 0.203: v14.12,25.83 14.12,25.86 v9.55,30.43 | v19.81,29.06 19.81,31.5 YB.TP 19.51,31.83 18.47,32.87 v18.47,32.99 | v6.55,21.51 7.82,21.51 9.19,20.14 v9.27,20.09 9.27,19.58 9.75,19.1 9.75,17.4 v9.78,17.37 9.85,17.32 10.64,17.32 15.57,12.39 17.58,12.39 19.13,10.85 20.14,10.85 21.26,9.73 v21.34,9.68 25.88,5.13 v26.01,5.13 | v25.76,18.49 25.78,18.47 25.78,16.87 v26.52,16.13 26.59,16.08 27.41,15.27 v30.15,15.27 | v15.54,6.63 v17.12,5.05
YC  (via drill 0.33)
  Top 0.203: v15.95,26.44 15.32,27.08 HC2.1 | v18.67,25.07 18.67,25.5 19.34,26.18 | 19.34,26.18 20.24,27.08 AC2.1 | 2.5,21.22 0.97,22.76 0.97,22.81 0.99,22.84 0.99,22.94 1.02,22.96 1.02,23.04 1.04,23.06 1.04,23.14 1.07,23.16 1.07,23.22 1.09,23.24 1.09,23.29 1.14,23.34 1.14,23.42 1.17,23.44 1.17,23.5 1.22,23.55 1.22,23.62 1.25,23.65 1.25,23.7 1.29,23.75 1.29,23.82 1.32,23.85 1.32,23.9 1.35,23.93 1.35,23.98 1.4,24.03 1.4,24.11 1.42,24.13 1.42,24.18 1.47,24.23 1.47,24.31 1.5,24.33 1.5,24.38 1.55,24.43 1.55,24.51 1.57,24.54 1.57,24.59 1.63,24.64 1.63,24.71 1.65,24.74 1.65,24.79 1.7,24.84 1.7,24.92 1.73,24.94 1.73,24.99 1.78,25.04 1.78,25.12 1.8,25.15 1.8,25.2 8.51,31.9 9.12,31.9 9.23,31.79 | 2.5,21.22 2.92,20.8 3.61,20.8 GC1.2 | 9.23,31.79 10.62,30.4 10.54,30.33 HC1.2 | 14.48,33.55 14.5,33.58 14.55,33.58 14.6,33.63 14.66,33.63 16.15,35.13 16.43,35.13 16.46,35.15 16.79,35.15 16.82,35.18 17.27,35.18 17.3,35.2 17.96,35.2 18.44,34.72 18.44,34.7 20.78,32.36 AC1.2 | 14.48,33.55 14.43,33.55 14.4,33.53 12.39,33.53 11.68,34.24 9.23,31.79 | v14.5,33.22 14.5,33.48 14.48,33.55 | v18.97,26.54 19.34,26.18 | v26.52,17.17 25.48,16.13 26.21,15.39 26.29,15.39 26.37,15.32 27.08,15.32 CC2.1 | v26.49,19.23 26.49,19.66 27.08,20.24 BC2.1 | v33.86,23.98 33.93,24.05 32.59,25.4 30.94,25.4 30.56,25.02 30.33,25.02 BC1.2 | v33.38,16.2 31.95,14.78 CC1.2 | v6.07,7.06 6.04,7.04 5.23,7.85 FC1.2 | v9.65,4.5 10.74,3.4 14.55,3.4 14.76,3.61 EC1.2 | v9.04,16.13 8.48,15.57 8.48,15.29 FC2.1 | v6.35,19.15 6.35,19.25 6.91,19.81 8,19.81 8.46,20.27 GC2.1 | v17.14,9.78 15.82,8.46 15.32,8.46 EC2.1
  Top 0.203: v18.47,9.02 18.47,9.04 19.51,10.08 20.24,9.35 20.24,8.48 DC2.1 | v23.62,2.23 25.71,4.32 25.02,5 25.02,5.23 DC1.2 | v1.6,20.3 2.44,21.13 2.44,21.16 2.5,21.22
  Route2 0.203: v1.6,20.3 2.74,19.15 v6.35,19.15
  Route15 0.203: v6.07,7.06 9.04,10.03 v9.04,16.13
  Bottom 0.203: v15.95,26.44 16.36,26.44 16.87,25.93 17.8,25.93 v18.67,25.07 | v14.5,33.22 15.98,31.75 YC.TP 15.49,32.11 15.49,29.79 16.15,29.13 16.15,28.88 18.49,26.54 v18.97,26.54 | v26.52,17.17 26.52,19.2 v26.49,19.23 26.59,19.23 28.73,17.09 29.85,18.21 | v33.86,23.98 33.86,23.34 31.32,20.8 31.12,20.8 29.49,19.18 29.85,18.82 29.85,18.21 | 29.85,18.21 29.92,18.16 30.76,17.32 32.03,17.32 32.05,17.3 32.11,17.3 32.16,17.25 32.23,17.25 32.28,17.2 32.36,17.2 32.41,17.14 32.46,17.14 33.38,16.23 v33.38,16.2 33.32,16.13 33.32,15.7 31.32,13.69 31.14,13.69 30.28,12.83 30.28,9.6 31.29,8.59 31.29,7.98 25.1,1.78 24.11,1.78 23.7,2.18 v23.62,2.23 22.84,2.23 21.97,3.1 21.97,3.15 21.92,3.2 21.92,3.28 21.87,3.33 21.87,3.4 21.82,3.45 21.82,3.5 21.79,3.53 21.79,5.31 22.2,5.71 21.46,6.45 21.06,6.45 18.54,8.97 v18.47,9.02 17.93,9.02 17.22,9.73 v17.14,9.78 16.66,9.78 13.46,12.98 12.22,12.98 9.12,16.08 v9.04,16.13 9.04,16.46 v6.35,19.15 | v6.07,7.06 7.11,7.06 9.65,4.52 v9.65,4.5
YD  (via drill 0.33)
  Top 0.203: 26.23,14.8 24.66,16.36 27.36,19.05 BD2.1 27.36,19.13 28.14,19.91 28.19,19.91 28.22,19.94 28.3,19.94 28.32,19.96 28.4,19.96 28.42,19.99 28.47,19.99 28.5,20.02 28.55,20.02 29.31,20.78 29.31,21.16 29.97,21.82 29.97,22.28 30.05,22.35 30.05,22.4 30.35,22.71 30.4,22.71 30.46,22.76 30.51,22.76 30.56,22.81 30.61,22.81 30.99,23.19 30.99,23.67 BD1.2 | 26.23,14.8 26.7,14.33 26.7,14.1 CD2.1 | v29.54,13.06 29.79,13.31 30.18,12.93 30.76,12.93 30.81,12.98 30.86,12.98 31.17,13.28 31.52,13.28 CD1.2 | v26.04,14.61 26.23,14.8 | v20.04,25.81 20.93,26.7 21.46,26.7 AD2.1 | v17.17,26.67 17.2,26.7 16.54,27.36 HD2.1 | v10.82,31.77 10.95,31.9 11.86,30.99 HD1.2 | v24.66,31.24 24.26,31.65 23.39,31.65 23.34,31.6 23.29,31.6 23.27,31.57 23.22,31.57 23.19,31.55 22.25,31.55 AD1.2 | 9.44,20.97 8.89,21.51 8.87,21.49 GD2.1 | 9.44,20.97 10.01,20.4 10.01,19.79 9.75,19.53 9.75,18.47 8.2,16.92 8.2,16.54 FD2.1 | v3.12,21.64 3.73,22.25 GD1.2 | v9.6,21.13 9.44,20.97 | v19.51,9.04 19.51,9.02 19.05,8.56 19.05,8.2 DD2.1 | v24.66,4.32 23.95,4.32 23.7,4.57 DD1.2 | v14.88,5.49 14.2,4.8 14.2,4.75 14.17,4.72 14.17,4.67 14.15,4.65 14.15,4.57 14.12,4.55 14.12,4.5 13.66,4.04 13.31,4.04 ED1.2 | v12.8,7.54 12.8,7.95 12.88,8.03 12.88,8.08 13.28,8.48 13.33,8.48 13.39,8.53 13.46,8.53 13.49,8.56 13.79,8.56 ED2.1 | v5.94,13.13 5.79,12.98 5.46,12.98 5.41,12.93 5.36,12.93 5.31,12.88 5.23,12.88 5.18,12.83 5.13,12.83 5.08,12.78 5,12.78 4.6,12.37 4.6,11.89 FD1.2
  Route2 0.203: v19.51,9.04 19.51,7.42 17.37,7.42 15.44,5.49 v14.88,5.49
  Route15 0.203: v24.66,31.24 22.86,29.44 20.55,29.44 20.55,26.31 v20.04,25.81 | v3.12,21.64 4.6,20.17 4.6,14.48 v5.94,13.13 | v26.04,14.61 26.06,14.58 26.06,12.7 22.3,8.94 19.51,8.94 v19.51,9.04
  Bottom 0.203: v29.54,13.06 27.58,13.06 v26.04,14.61 25.98,14.68 25.98,15.62 25.78,15.82 25.78,16.28 25.38,16.69 25.38,17.83 25.02,18.19 25.02,19.51 20.65,23.88 20.65,25.17 20.09,25.73 v20.04,25.81 18.64,25.81 17.48,26.98 | 17.48,26.98 14.91,29.54 14.66,29.54 YD.TP 12.37,31.77 v10.82,31.77 | 17.48,26.98 v17.17,26.67 | v3.12,21.64 5.54,21.64 7.32,23.42 v9.6,21.13 | v19.51,9.04 19.94,9.04 v24.66,4.32 | v14.88,5.49 14.86,5.49 v12.8,7.54 12.72,7.59 7.19,13.13 v5.94,13.13
YE  (via drill 0.33)
  Top 0.203: v10.9,4.32 11.12,4.55 11.89,4.55 EE1.2 | v4.29,10.87 3.94,11.23 3.94,12.12 3.96,12.14 3.96,12.22 4.01,12.27 4.01,13.28 FE1.2 | v21.21,2.85 22.25,3.89 DE1.2 | EE2.1 12.95,9.45 13.82,9.45 13.84,9.47 14.76,9.47 15.26,9.98 15.72,9.98 17.07,11.33 17.2,11.33 17.78,11.91 FE2.1 17.83,12.01 21.03,15.21 21.03,15.88 22.29,17.13 | 22.29,17.13 22.94,17.78 DE2.1 | v25.32,13.74 26.11,12.95 CE2.1 | v22.91,16.51 22.29,17.13 | v30.56,8.28 32.18,9.91 32.18,11.02 31.34,11.86 31.01,11.86 CE1.2 | 22.99,28.4 22.55,27.96 22.55,27.69 22.53,27.66 22.53,27.61 22.48,27.56 22.48,27.48 22.43,27.43 22.43,27.36 22.38,27.3 22.38,27.25 22.35,27.23 22.35,27.18 22.3,27.13 22.3,27.08 22.23,27 22.61,26.62 AE2.1 | 22.99,28.4 22.99,28.88 23.7,29.59 23.7,29.64 23.75,29.69 23.75,29.77 23.8,29.82 23.8,29.87 23.85,29.92 23.85,29.97 23.88,30 23.88,30.05 23.93,30.1 23.93,30.71 23.65,30.99 AE1.2 | v31.24,24.66 31.65,24.26 31.65,23.42 31.6,23.37 31.6,23.29 31.55,23.24 31.55,22.28 BE1.2 | v23.44,27.94 22.99,28.4 | 14.77,20.61 BE2.1 | 14.77,20.61 HE2.1 | v12.24,23.11 11.76,22.63 9.45,22.63 GE2.1 | v14.43,20.95 14.77,20.61 | v4.32,24.66 4.57,24.41 4.57,23.7 GE1.2 | v11.68,33.2 11.66,33.17 13.28,31.55 HE1.2
  Route2 0.203: v10.9,4.32 11.3,3.91 20.14,3.91 v21.21,2.85 21.29,2.9 25.58,7.19 29.46,7.19 v30.56,8.28 | v31.24,24.66 27.96,27.94 v23.44,27.94 | v4.32,24.66 4.47,24.82 10.57,24.82 12.24,23.14 v12.24,23.11
  Route15 0.203: v23.44,27.94 16.74,21.23 14.43,21.23 v14.43,20.95
  Bottom 0.203: YE.TP 11.94,4.32 v10.9,4.32 10.82,4.37 4.32,10.87 v4.29,10.87 | v22.91,16.51 25.32,14.1 v25.32,13.74 25.38,13.66 26.2,12.84 | v30.56,8.28 30.56,8.48 26.2,12.84 | v12.24,23.11 12.27,23.11 v14.43,20.95 14.5,20.9 15.87,19.53 16.61,19.53 23.34,12.8 23.83,12.8 24.99,11.63 26.2,12.84 | v11.68,33.2 9.8,33.2 2.79,26.19 v4.32,24.66
YF  (via drill 0.33)
  Top 0.203: DF1.2 20.8,3.58 20.45,3.58 19.79,2.92 19.71,2.92 v19.05,2.26 19,2.18 19,1.4 18.21,0.61 18.16,0.61 18.11,0.56 18.06,0.56 18.03,0.53 17.98,0.53 17.96,0.51 16.08,0.51 13.59,3 10.08,3 8.6,4.48 | 8.6,4.48 8.41,4.29 7.75,4.29 1.88,10.16 1.88,13.01 3.61,14.73 FF1.2 | 8.6,4.48 9.35,5.23 10.54,5.23 EF1.2 | v8.36,24.08 8.41,24.13 8.94,23.6 9.35,23.6 9.37,23.62 9.47,23.62 9.52,23.67 10.11,23.67 GF2.1 | v5.11,26.01 5.11,25.15 5.23,25.02 GF1.2 | v12.24,21.01 12.37,20.88 12.37,20.04 HF2.1 | v15.87,13.13 15.54,12.8 15.54,12.47 FF2.1 15.52,12.37 15.24,12.09 14.93,12.09 14.91,12.06 14.83,12.06 14.78,12.01 14.73,12.01 13.82,11.1 12.62,11.1 11.89,10.36 11.89,10.13 EF2.1 11.79,10.11 11.68,10.01 11.2,10.01 11.18,9.98 11,9.98 10.62,9.6 10.62,9.5 10.59,9.47 10.59,9.04 10.34,8.79 v10.34,7.92 | 22.57,24.32 23.67,25.43 AF2.1 | 22.57,24.32 21.44,23.19 20.04,23.19 BF2.1 20.14,23.11 v20.14,22.25 | v16.89,29.18 16.61,28.91 16.48,28.91 16.46,28.88 16.41,28.88 15.49,29.79 15.49,30.4 15.75,30.66 15.75,31.19 15.01,31.93 HF1.2 | 22.57,24.32 v22.43,24.46 | v23.19,14.55 DF2.1 | v25.02,12.7 25.63,12.09 CF2.1 | v31.24,10.9 30.91,10.57 30.33,10.57 CF1.2 | v32.74,20.95 32.56,20.78 31.93,20.78 BF1.2 | v25.76,30.84 25.25,30.33 25.02,30.33 AF1.2
  Route2 0.203: v31.24,10.9 30.48,11.66 26.06,11.66 v25.02,12.7 | v15.87,13.13 17.3,14.55 v23.19,14.55
  Route15 0.203: v25.76,30.84 26.54,30.05 26.54,28.02 32.74,21.82 v32.74,20.95
  Bottom 0.203: v19.05,2.26 17.55,2.26 YF.TP 15.93,3.86 14.4,3.86 v10.34,7.92 | v5.11,26.01 7.04,24.08 v8.36,24.08 8.43,24.03 11.46,21.01 v12.24,21.01 12.29,20.93 15.87,17.35 v15.87,13.13 | v16.89,29.18 17.7,29.18 v22.43,24.46 | v25.02,12.7 23.19,14.53 v23.19,14.55 23.14,14.63 22.5,15.27 22.5,15.88 20.14,18.24 v20.14,22.25 | v32.74,20.95 32.97,20.95 34.11,19.81 34.11,18.69 33.02,17.6 34.11,16.51 34.11,15.29 32.44,13.61 32.89,13.16 32.89,13.11 32.94,13.06 32.94,12.98 32.99,12.93 32.99,12.85 33.04,12.8 33.04,12.75 33.07,12.72 33.07,12.19 33.65,11.61 33.65,10.97 32.41,9.73 v31.24,10.9
YG  (via drill 0.33)
  Top 0.203: v8.1,5.03 9.14,6.07 9.27,6.07 EG1.2 | v11.38,11.71 10.95,11.28 EG2.1 | v16.69,1.27 18.8,3.38 19.3,3.38 DG1.2 | v5.33,17.75 4.57,16.99 4.39,16.99 4.37,16.97 4.17,16.97 4.14,16.94 4.01,16.94 3.4,16.33 3.4,16.26 FG1.2 | 17.17,17.17 FG2.1 | 17.17,17.17 BG2.1 21.95,22.02 21.97,22.05 21.97,22.84 23.75,24.61 AG2.1 | v21.44,12.8 21.92,13.28 21.92,13.61 DG2.1 | v23.5,12.06 CG2.1 | v13.39,20.95 13.61,21.18 13.61,21.92 HG2.1 | v10.95,23.39 GG2.1 | v6.04,27.28 6.07,27.25 GG1.2 | CG1.2 29.49,8.31 v29.52,8.28 29.57,8.2 30.23,7.54 30.86,7.54 33.78,10.46 33.78,10.52 33.83,10.57 33.83,10.62 33.86,10.64 33.86,10.72 33.91,10.77 33.91,10.82 33.93,10.85 33.93,10.92 33.98,10.97 33.98,11.02 34.01,11.05 34.01,11.1 34.04,11.12 34.04,11.18 34.06,11.2 33.53,11.73 33.53,14.53 33.55,14.55 33.55,14.61 33.58,14.63 33.58,14.68 33.63,14.73 33.63,14.81 34.9,16.08 32.18,18.8 32.18,19.28 BG1.2 32.21,19.38 33.53,20.7 33.53,21.21 32.28,22.45 v32.28,24.66 | v27.28,29.54 27.25,29.52 26.31,29.52 AG1.2 | v15.54,33.33 15.32,33.1 16.23,32.18 HG1.2 | v17.12,17.22 17.17,17.17
  Route2 0.203: v11.38,11.71 16.89,17.22 v17.12,17.22
  Route15 0.203: v11.38,11.71 8.1,8.43 v8.1,5.03 | v15.54,33.33 15.24,33.02 15.24,30.73 11.63,27.13 11.63,25.09 10.95,24.41 v10.95,23.39
  Bottom 0.203: v8.1,5.03 8.1,5 9.35,3.76 10.41,3.76 10.59,3.58 10.82,3.58 11.73,2.67 11.79,2.67 11.84,2.62 11.91,2.62 11.96,2.56 12.04,2.56 12.09,2.52 12.14,2.52 12.17,2.49 15.47,2.49 v16.69,1.27 17.35,0.61 17.4,0.61 17.45,0.56 17.5,0.56 17.53,0.53 17.58,0.53 17.6,0.51 18.34,0.51 20.47,2.64 20.47,2.9 YG.TP | v11.38,11.71 v5.33,17.75 | 17.06,17.16 21.36,12.85 v21.44,12.8 22.76,12.8 v23.5,12.06 23.55,11.99 27.25,8.28 v29.52,8.28 | 17.06,17.16 16.15,18.06 15.98,18.06 13.39,20.65 v13.39,20.95 13.31,21.01 10.95,23.37 v10.95,23.39 10.87,23.44 7.04,27.28 v6.04,27.28 | v27.28,29.54 27.41,29.54 v32.28,24.66 | v17.12,17.22 17.06,17.16
YH  (via drill 0.33)
  Top 0.203: EH1.2 8.08,7.04 8.08,8.18 8.43,8.53 8.43,10.54 8.46,10.57 8.46,10.9 8.58,11.02 8.58,11.46 8.81,11.68 8.87,11.68 9.04,11.86 9.09,11.86 9.19,11.96 10.03,11.96 10.11,11.89 EH2.1 10.08,12.04 10.08,13.26 10.69,13.87 10.69,15.37 10.95,15.62 11,15.62 11.05,15.67 11.12,15.67 11.18,15.72 11.25,15.72 11.3,15.77 11.35,15.77 11.38,15.8 11.43,15.8 11.48,15.85 12.67,15.85 12.74,15.79 | 12.74,15.79 HH1.2 14.78,17.86 15.54,18.62 15.54,19.1 16.88,20.43 | 12.74,15.79 12.5,15.54 12.39,15.54 FH2.1 | 16.88,20.43 17.25,20.8 17.78,20.8 BH1.2 | v15.26,22.15 15.52,22.4 15.52,23.16 HH2.1 | 16.88,20.43 v16.82,20.5 | v12.24,24.66 12.45,24.87 11.89,25.43 GH2.1 | v8.79,26.82 8.13,27.48 7.04,27.48 GH1.2 | 19.71,11.56 19.76,11.61 19.76,11.66 19.79,11.68 19.79,11.73 20.02,11.96 DH2.1 | 19.71,11.56 19.71,11.18 20.75,10.13 21.03,10.41 23.39,10.41 23.67,10.13 CH2.1 | v28.02,6.1 28.52,6.6 28.52,8.08 CH1.2 | v19.43,11.58 19.63,11.58 19.71,11.56 | 20.12,17.09 20.8,17.78 DH1.2 20.9,17.83 23.09,20.02 23.17,20.02 BH2.1 23.24,20.12 23.47,20.34 23.47,20.62 23.5,20.65 23.5,20.73 23.55,20.78 23.55,20.83 24.66,21.95 24.66,22.48 25.43,23.24 AH2.1 25.32,23.7 v24.41,23.7 | 20.12,17.09 17.78,14.76 FH1.2 17.76,14.66 17.58,14.48 v18.42,13.64 | v24.18,27.2 24.99,28.02 25.76,28.02 25.78,28.04 25.91,28.04 25.93,28.07 26.01,28.07 26.47,28.52 27.46,28.52 AH1.2 | v20.3,16.92 20.12,17.09
  Bottom 0.203: v8.79,26.82 10.01,26.82 12.17,24.66 v12.24,24.66 12.72,24.66 15.19,22.2 v15.26,22.15 15.26,22.05 v16.82,20.5 16.87,20.42 16.87,20.34 v20.3,16.92 | 27.05,5.13 24.46,2.54 24.38,2.54 YH.TP | 27.05,5.13 v28.02,6.1 | 27.05,5.13 20.6,11.58 v19.43,11.58 19.38,11.66 19.38,12.68 v18.42,13.64 | v24.18,27.2 24.18,23.93 v24.41,23.7